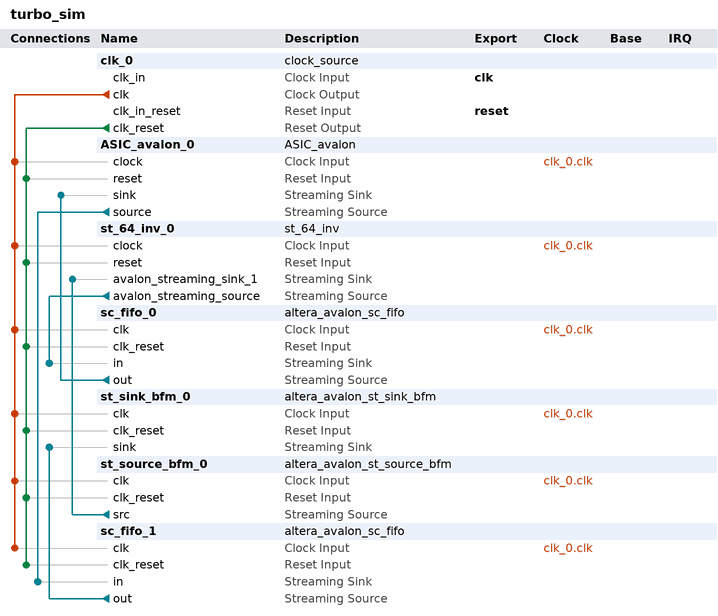
[diagram p0: system contents]
# Platform Designer (Qsys) system turbo_sim, Stratix IV EP4SGX230KF40C2
# Parameters at their usual value, and those the tool derives, are not listed.
package require -exact qsys 16.0
create_system turbo_sim
set_project_property DEVICE_FAMILY {Stratix IV}
set_project_property DEVICE EP4SGX230KF40C2

add_instance clk_0 clock_source 16.0
set_instance_parameter_value clk_0 clockFrequency 50000000

add_instance ASIC_avalon_0 ASIC_avalon 1.0

add_instance st_64_inv_0 st_64_inv 1.0

add_instance sc_fifo_0 altera_avalon_sc_fifo 16.0
set_instance_parameter_value sc_fifo_0 BITS_PER_SYMBOL 8
set_instance_parameter_value sc_fifo_0 CHANNEL_WIDTH 0
set_instance_parameter_value sc_fifo_0 ERROR_WIDTH 0
set_instance_parameter_value sc_fifo_0 FIFO_DEPTH 512
set_instance_parameter_value sc_fifo_0 SYMBOLS_PER_BEAT 4
set_instance_parameter_value sc_fifo_0 USE_FILL_LEVEL 1
set_instance_parameter_value sc_fifo_0 USE_MEMORY_BLOCKS 1
set_instance_parameter_value sc_fifo_0 USE_PACKETS 1
set_instance_parameter_value sc_fifo_0 USE_STORE_FORWARD 1

add_instance st_sink_bfm_0 altera_avalon_st_sink_bfm 16.0
set_instance_parameter_value st_sink_bfm_0 ST_CHANNEL_W 1
set_instance_parameter_value st_sink_bfm_0 ST_ERROR_W 1
set_instance_parameter_value st_sink_bfm_0 ST_MAX_CHANNELS 1
set_instance_parameter_value st_sink_bfm_0 ST_NUMSYMBOLS 4
set_instance_parameter_value st_sink_bfm_0 ST_READY_LATENCY 0
set_instance_parameter_value st_sink_bfm_0 ST_SYMBOL_W 8
set_instance_parameter_value st_sink_bfm_0 USE_CHANNEL 0
set_instance_parameter_value st_sink_bfm_0 USE_EMPTY 0
set_instance_parameter_value st_sink_bfm_0 USE_ERROR 0
set_instance_parameter_value st_sink_bfm_0 USE_PACKET 1
set_instance_parameter_value st_sink_bfm_0 USE_READY 1
set_instance_parameter_value st_sink_bfm_0 USE_VALID 1
set_instance_parameter_value st_sink_bfm_0 VHDL_ID 0

add_instance st_source_bfm_0 altera_avalon_st_source_bfm 16.0
set_instance_parameter_value st_source_bfm_0 ST_CHANNEL_W 1
set_instance_parameter_value st_source_bfm_0 ST_ERROR_W 1
set_instance_parameter_value st_source_bfm_0 ST_MAX_CHANNELS 1
set_instance_parameter_value st_source_bfm_0 ST_NUMSYMBOLS 4
set_instance_parameter_value st_source_bfm_0 ST_SYMBOL_W 8
set_instance_parameter_value st_source_bfm_0 USE_CHANNEL 0
set_instance_parameter_value st_source_bfm_0 USE_EMPTY 0
set_instance_parameter_value st_source_bfm_0 USE_ERROR 0
set_instance_parameter_value st_source_bfm_0 USE_PACKET 1
set_instance_parameter_value st_source_bfm_0 USE_READY 1
set_instance_parameter_value st_source_bfm_0 USE_VALID 1

add_instance sc_fifo_1 altera_avalon_sc_fifo 16.0
set_instance_parameter_value sc_fifo_1 BITS_PER_SYMBOL 8
set_instance_parameter_value sc_fifo_1 CHANNEL_WIDTH 0
set_instance_parameter_value sc_fifo_1 ERROR_WIDTH 0
set_instance_parameter_value sc_fifo_1 FIFO_DEPTH 256
set_instance_parameter_value sc_fifo_1 SYMBOLS_PER_BEAT 4
set_instance_parameter_value sc_fifo_1 USE_FILL_LEVEL 1
set_instance_parameter_value sc_fifo_1 USE_MEMORY_BLOCKS 1
set_instance_parameter_value sc_fifo_1 USE_PACKETS 1
set_instance_parameter_value sc_fifo_1 USE_STORE_FORWARD 1

# connections
add_connection clk_0.clk ASIC_avalon_0.clock clock
add_connection clk_0.clk sc_fifo_0.clk clock
add_connection clk_0.clk sc_fifo_1.clk clock
add_connection clk_0.clk st_64_inv_0.clock clock
add_connection clk_0.clk st_sink_bfm_0.clk clock
add_connection clk_0.clk st_source_bfm_0.clk clock
add_connection clk_0.clk_reset ASIC_avalon_0.reset reset
add_connection clk_0.clk_reset sc_fifo_0.clk_reset reset
add_connection clk_0.clk_reset sc_fifo_1.clk_reset reset
add_connection clk_0.clk_reset st_64_inv_0.reset reset
add_connection clk_0.clk_reset st_sink_bfm_0.clk_reset reset
add_connection clk_0.clk_reset st_source_bfm_0.clk_reset reset
add_connection ASIC_avalon_0.source sc_fifo_1.in avalon_streaming
add_connection sc_fifo_0.out ASIC_avalon_0.sink avalon_streaming
add_connection sc_fifo_1.out st_sink_bfm_0.sink avalon_streaming
add_connection st_64_inv_0.avalon_streaming_source sc_fifo_0.in avalon_streaming
add_connection st_source_bfm_0.src st_64_inv_0.avalon_streaming_sink_1 avalon_streaming

# exported interfaces
add_interface clk clock sink
set_interface_property clk EXPORT_OF clk_0.clk_in
add_interface reset reset sink
set_interface_property reset EXPORT_OF clk_0.clk_in_reset

set_interconnect_requirement {$system} qsys_mm.clockCrossingAdapter HANDSHAKE
set_interconnect_requirement {$system} qsys_mm.enableEccProtection FALSE
set_interconnect_requirement {$system} qsys_mm.insertDefaultSlave FALSE
set_interconnect_requirement {$system} qsys_mm.maxAdditionalLatency 1

save_system turbo_sim.qsys
